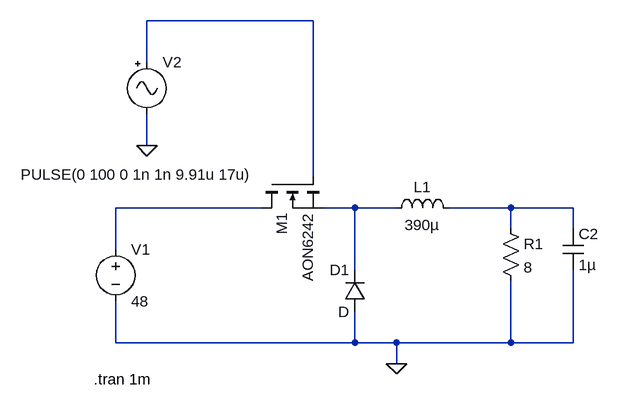
[diagram p0: schematic Draft2.asc]
Draft2.asc, the LTspice schematic file:
Version 4
SHEET 1 880 680
WIRE 32 -400 -224 -400
WIRE -224 -336 -224 -400
WIRE -224 -208 -224 -256
WIRE 32 -160 32 -400
WIRE -48 -112 -272 -112
WIRE 96 -112 48 -112
WIRE 160 -112 96 -112
WIRE 336 -112 240 -112
WIRE 432 -112 336 -112
WIRE 336 -80 336 -112
WIRE 432 -80 432 -112
WIRE -272 -48 -272 -112
WIRE 96 -16 96 -112
WIRE -272 96 -272 32
WIRE 96 96 96 48
WIRE 96 96 -272 96
WIRE 160 96 96 96
WIRE 336 96 336 0
WIRE 336 96 160 96
WIRE 432 96 432 -16
WIRE 432 96 336 96
WIRE 160 128 160 96
FLAG 160 128 0
FLAG -224 -208 0
SYMBOL ind 144 -96 R270
WINDOW 0 32 56 VTop 2
WINDOW 3 5 56 VBottom 2
SYMATTR InstName L1
SYMATTR Value 390µ
SYMBOL res 320 -96 R0
SYMATTR InstName R1
SYMATTR Value 8
SYMBOL diode 112 48 R180
WINDOW 0 24 64 Left 2
WINDOW 3 24 0 Left 2
SYMATTR InstName D1
SYMBOL nmos -48 -160 M90
SYMATTR InstName M1
SYMATTR Value AON6242
SYMBOL voltage -272 -64 R0
WINDOW 123 0 0 Left 0
WINDOW 39 0 0 Left 0
SYMATTR InstName V1
SYMATTR Value 48
SYMBOL Misc\\signal -224 -352 R0
WINDOW 3 -194 189 Left 2
WINDOW 123 0 0 Left 0
WINDOW 39 0 0 Left 0
SYMATTR InstName V2
SYMATTR Value PULSE(0 100 0 1n 1n 9.91u 17u)
SYMBOL cap 416 -80 R0
SYMATTR InstName C2
SYMATTR Value 1µ
TEXT -306 152 Left 2 !.tran 1m

The netlist it stands for:
* Draft2.asc
L1 N003 N004 390µ
R1 N004 0 8
D1 0 N003 D
M1 N002 N001 N003 N003 AON6242
V1 N002 0 48
V2 N001 0 PULSE(0 100 0 1n 1n 9.91u 17u)
C2 N004 0 1µ
.model D D
.lib standard.dio
.model NMOS NMOS
.model PMOS PMOS
.lib standard.mos
.tran 1m
.backanno
.end